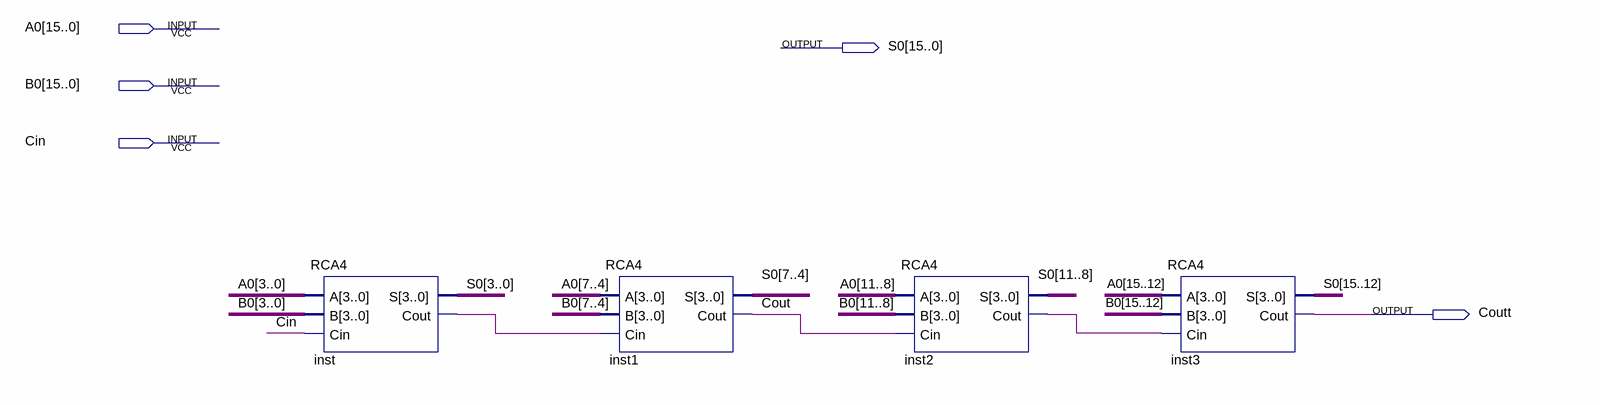
[diagram p0: schematic sheet]
// Quartus schematic RCA16.bdf as structural Verilog: 4 symbols, 5 pins
module RCA16 (
  input  [15:0] A0,
  input  [15:0] B0,
  input  Cin,
  output [15:0] S0,
  output Coutt
);

  wire Cout, inst2_cout, inst_cout;

  RCA4 inst (.A(A0[3:0]), .B(B0[3:0]), .Cin(Cin), .S(S0[3:0]), .Cout(inst_cout));
  RCA4 inst1 (.A(A0[7:4]), .B(B0[7:4]), .Cin(inst_cout), .S(S0[7:4]), .Cout(Cout));
  RCA4 inst2 (.A(A0[11:8]), .B(B0[11:8]), .Cin(Cout), .S(S0[11:8]), .Cout(inst2_cout));
  RCA4 inst3 (.A(A0[15:12]), .B(B0[15:12]), .Cin(inst2_cout), .S(S0[15:12]), .Cout(Coutt));
endmodule
